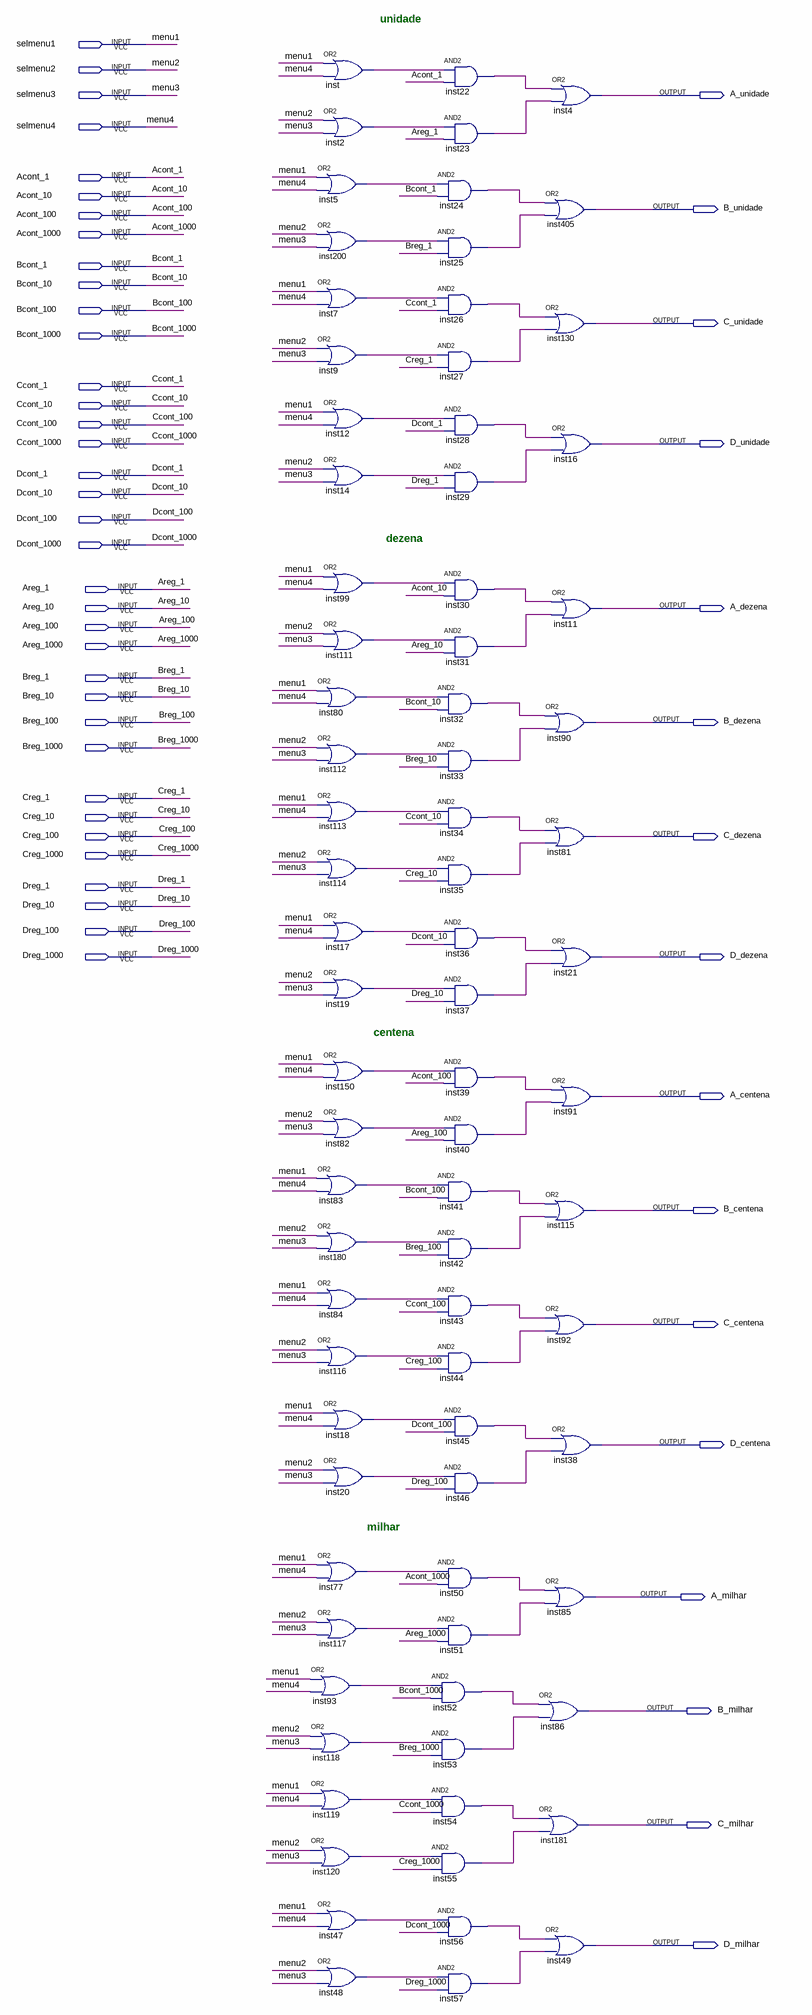
[diagram p0: schematic sheet]
// Quartus schematic Mostragem_display.bdf as structural Verilog: 80 symbols, 52 pins
module Mostragem_display (
  input  selmenu1,
  input  selmenu2,
  input  selmenu3,
  input  selmenu4,
  input  Acont_1,
  input  Acont_10,
  input  Acont_100,
  input  Acont_1000,
  input  Bcont_1,
  input  Bcont_10,
  input  Bcont_100,
  input  Bcont_1000,
  input  Ccont_1,
  input  Ccont_10,
  input  Ccont_100,
  input  Ccont_1000,
  input  Dcont_1,
  input  Dcont_10,
  input  Dcont_100,
  input  Dcont_1000,
  input  Areg_1,
  input  Areg_10,
  input  Areg_100,
  input  Areg_1000,
  input  Breg_1,
  input  Breg_10,
  input  Breg_100,
  input  Breg_1000,
  input  Creg_1,
  input  Creg_10,
  input  Creg_100,
  input  Creg_1000,
  input  Dreg_1,
  input  Dreg_10,
  input  Dreg_100,
  input  Dreg_1000,
  output A_unidade,
  output B_unidade,
  output C_unidade,
  output D_unidade,
  output A_dezena,
  output B_dezena,
  output C_dezena,
  output D_dezena,
  output A_centena,
  output B_centena,
  output C_centena,
  output D_centena,
  output A_milhar,
  output B_milhar,
  output C_milhar,
  output D_milhar
);

  wire inst2_out, inst5_out, inst7_out, inst9_out, inst12_out, inst14_out, inst17_out, inst18_out,
       inst19_out, inst20_out, inst22_out, inst23_out, inst24_out, inst25_out, inst26_out, inst27_out,
       inst28_out, inst29_out, inst30_out, inst31_out, inst32_out, inst33_out, inst34_out, inst35_out,
       inst36_out, inst37_out, inst39_out, inst40_out, inst41_out, inst42_out, inst43_out, inst44_out,
       inst45_out, inst46_out, inst47_out, inst48_out, inst50_out, inst51_out, inst52_out, inst53_out,
       inst54_out, inst55_out, inst56_out, inst57_out, inst77_out, inst80_out, inst82_out, inst83_out,
       inst84_out, inst93_out, inst99_out, inst111_out, inst112_out, inst113_out, inst114_out, inst116_out,
       inst117_out, inst118_out, inst119_out, inst120_out, inst150_out, inst180_out, inst200_out, inst_out;

  or inst5 (inst5_out, selmenu1, selmenu4);
  or inst200 (inst200_out, selmenu2, selmenu3);
  or inst7 (inst7_out, selmenu1, selmenu4);
  or inst9 (inst9_out, selmenu2, selmenu3);
  or inst80 (inst80_out, selmenu1, selmenu4);
  or inst112 (inst112_out, selmenu2, selmenu3);
  or inst113 (inst113_out, selmenu1, selmenu4);
  or inst114 (inst114_out, selmenu2, selmenu3);
  or inst83 (inst83_out, selmenu1, selmenu4);
  or inst180 (inst180_out, selmenu2, selmenu3);
  or inst84 (inst84_out, selmenu1, selmenu4);
  or inst116 (inst116_out, selmenu2, selmenu3);
  or inst77 (inst77_out, selmenu1, selmenu4);
  or inst117 (inst117_out, selmenu2, selmenu3);
  or inst93 (inst93_out, selmenu1, selmenu4);
  or inst118 (inst118_out, selmenu2, selmenu3);
  or inst119 (inst119_out, selmenu1, selmenu4);
  or inst120 (inst120_out, selmenu2, selmenu3);
  or inst47 (inst47_out, selmenu1, selmenu4);
  or inst48 (inst48_out, selmenu2, selmenu3);
  or inst (inst_out, selmenu1, selmenu4);
  or inst2 (inst2_out, selmenu2, selmenu3);
  or inst12 (inst12_out, selmenu1, selmenu4);
  or inst14 (inst14_out, selmenu2, selmenu3);
  or inst99 (inst99_out, selmenu1, selmenu4);
  or inst111 (inst111_out, selmenu2, selmenu3);
  or inst17 (inst17_out, selmenu1, selmenu4);
  or inst19 (inst19_out, selmenu2, selmenu3);
  or inst150 (inst150_out, selmenu1, selmenu4);
  or inst82 (inst82_out, selmenu2, selmenu3);
  or inst18 (inst18_out, selmenu1, selmenu4);
  or inst20 (inst20_out, selmenu2, selmenu3);
  and inst22 (inst22_out, inst_out, Acont_1);
  and inst23 (inst23_out, inst2_out, Areg_1);
  and inst24 (inst24_out, inst5_out, Bcont_1);
  and inst25 (inst25_out, inst200_out, Breg_1);
  and inst26 (inst26_out, inst7_out, Ccont_1);
  and inst27 (inst27_out, inst9_out, Creg_1);
  and inst28 (inst28_out, inst12_out, Dcont_1);
  and inst29 (inst29_out, inst14_out, Dreg_1);
  and inst30 (inst30_out, inst99_out, Acont_10);
  and inst31 (inst31_out, inst111_out, Areg_10);
  and inst32 (inst32_out, inst80_out, Bcont_10);
  and inst33 (inst33_out, inst112_out, Breg_10);
  and inst34 (inst34_out, inst113_out, Ccont_10);
  and inst35 (inst35_out, inst114_out, Creg_10);
  and inst36 (inst36_out, inst17_out, Dcont_10);
  and inst37 (inst37_out, inst19_out, Dreg_10);
  and inst39 (inst39_out, inst150_out, Acont_100);
  and inst40 (inst40_out, inst82_out, Areg_100);
  and inst41 (inst41_out, inst83_out, Bcont_100);
  and inst42 (inst42_out, inst180_out, Breg_100);
  and inst43 (inst43_out, inst84_out, Ccont_100);
  and inst44 (inst44_out, inst116_out, Creg_100);
  and inst45 (inst45_out, inst18_out, Dcont_100);
  and inst46 (inst46_out, inst20_out, Dreg_100);
  and inst50 (inst50_out, inst77_out, Acont_1000);
  and inst51 (inst51_out, inst117_out, Areg_1000);
  and inst52 (inst52_out, inst93_out, Bcont_1000);
  and inst53 (inst53_out, inst118_out, Breg_1000);
  and inst54 (inst54_out, inst119_out, Ccont_1000);
  and inst55 (inst55_out, inst120_out, Creg_1000);
  and inst56 (inst56_out, inst47_out, Dcont_1000);
  and inst57 (inst57_out, inst48_out, Dreg_1000);
  or inst4 (A_unidade, inst22_out, inst23_out);
  or inst405 (B_unidade, inst24_out, inst25_out);
  or inst130 (C_unidade, inst26_out, inst27_out);
  or inst16 (D_unidade, inst28_out, inst29_out);
  or inst11 (A_dezena, inst30_out, inst31_out);
  or inst90 (B_dezena, inst32_out, inst33_out);
  or inst81 (C_dezena, inst34_out, inst35_out);
  or inst21 (D_dezena, inst36_out, inst37_out);
  or inst91 (A_centena, inst39_out, inst40_out);
  or inst115 (B_centena, inst41_out, inst42_out);
  or inst92 (C_centena, inst43_out, inst44_out);
  or inst38 (D_centena, inst45_out, inst46_out);
  or inst85 (A_milhar, inst50_out, inst51_out);
  or inst86 (B_milhar, inst52_out, inst53_out);
  or inst181 (C_milhar, inst54_out, inst55_out);
  or inst49 (D_milhar, inst56_out, inst57_out);

  // Other names for the same wires on the sheet: menu1 = selmenu1; menu2 = selmenu2; menu3 = selmenu3;
  //   menu4 = selmenu4

  // Notes on the sheet:
  //   unidade
  //   dezena
  //   centena
  //   milhar
endmodule
